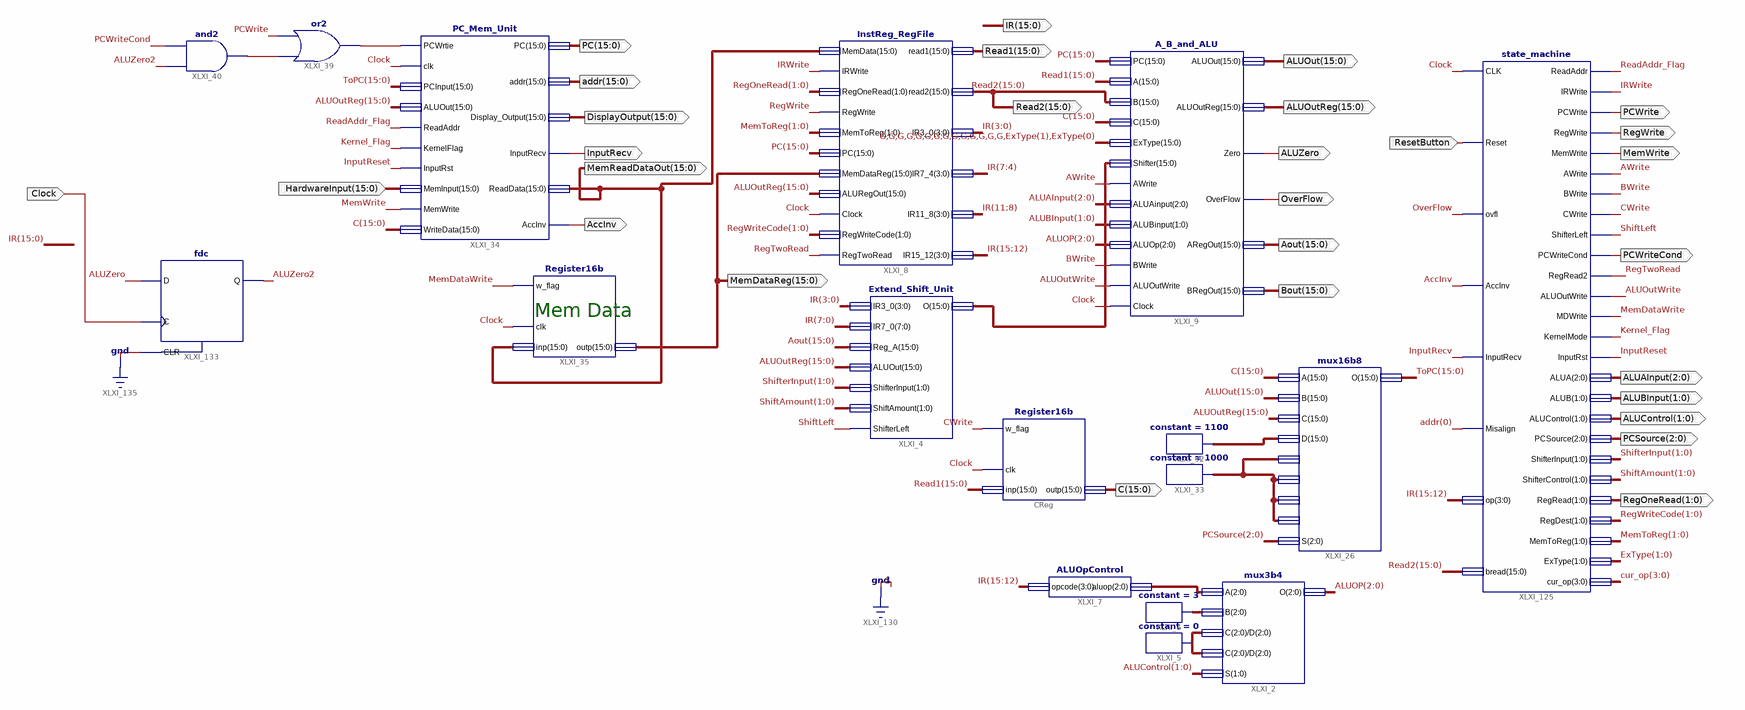
[diagram p0: schematic sheet 1]
// Xilinx ISE schematic Processor_Main_1.sch (spartan3e) as structural Verilog: 17 symbols, 30 ports
module Processor_Main_1 (
  input  Clock,
  input  [15:0] HardwareInput,
  input  ResetButton,
  output [15:0] Read2,
  output [15:0] ALUOut,
  output [15:0] ALUOutReg,
  output ALUZero2,
  output OverFlow,
  output [15:0] Aout,
  output [15:0] Bout,
  output RegWrite,
  output [15:0] Read1,
  output [15:0] PC,
  output [1:0] RegOneRead,
  output MemWrite,
  output [15:0] C,
  output PCWriteCond,
  output PCWrite,
  output [15:0] MemDataReg,
  output [15:0] MemReadDataOut,
  output [15:0] DisplayOutput,
  output [15:0] addr,
  output InputRecv,
  output AccInv,
  output [1:0] ALUBInput,
  output [2:0] ALUAInput,
  output [2:0] PCSource,
  output [1:0] ALUControl,
  output [15:0] IR,
  output ALUZero
);

  wire ALUOutWrite, AWrite, BWrite, CWrite, InputReset, IRWrite, Kernel_Flag, MemDataWrite, ReadAddr_Flag,
       RegTwoRead, ShiftLeft, XLXN_208, XLXN_209;
  wire [1:0] ExType, MemToReg, RegWriteCode, ShiftAmount, ShifterInput;
  wire [2:0] ALUOP, XLXN_41, XLXN_43, XLXN_44;
  wire [3:0] cur_op;
  wire [15:0] Shifter, ToPC, XLXN_171, XLXN_180;

  InstReg_RegFile XLXI_8 (
    .MemData(MemReadDataOut), .IRWrite(IRWrite), .RegOneRead(RegOneRead), .RegWrite(RegWrite),
    .MemToReg(MemToReg), .PC(PC), .MemDataReg(MemDataReg), .ALURegOut(ALUOutReg), .Clock(Clock),
    .RegWriteCode(RegWriteCode), .RegTwoRead(RegTwoRead), .read1(Read1), .read2(Read2), .IR3_0(IR[3:0]),
    .IR7_4(IR[7:4]), .IR11_8(IR[11:8]), .IR15_12(IR[15:12]));
  PC_Mem_Unit XLXI_34 (
    .PCWrtie(XLXN_209), .clk(Clock), .PCInput(ToPC), .ALUOut(ALUOutReg), .ReadAddr(ReadAddr_Flag),
    .KernelFlag(Kernel_Flag), .InputRst(InputReset), .MemInput(HardwareInput), .MemWrite(MemWrite),
    .WriteData(C), .PC(PC), .addr(addr), .Display_Output(DisplayOutput), .InputRecv(InputRecv),
    .ReadData(MemReadDataOut), .AccInv(AccInv));
  or XLXI_39 (XLXN_209, XLXN_208, PCWrite);
  and XLXI_40 (XLXN_208, ALUZero2, PCWriteCond);
  Register16b XLXI_35 (.w_flag(MemDataWrite), .clk(Clock), .inp(MemReadDataOut), .outp(MemDataReg));
  Extend_Shift_Unit XLXI_4 (
    .IR3_0(IR[3:0]), .IR7_0(IR[7:0]), .Reg_A(Aout), .ALUOut(ALUOutReg), .ShifterInput(ShifterInput),
    .ShiftAmount(ShiftAmount), .ShifterLeft(ShiftLeft), .O(Shifter));
  A_B_and_ALU XLXI_9 (
    .PC(PC), .A(Read1), .B(Read2), .C(C), .ExType({{14{1'b0}}, ExType}), .Shifter(Shifter), .AWrite(AWrite),
    .ALUAinput(ALUAInput), .ALUBinput(ALUBInput), .ALUOp(ALUOP), .BWrite(BWrite), .ALUOutWrite(ALUOutWrite),
    .Clock(Clock), .ALUOut(ALUOut), .ALUOutReg(ALUOutReg), .Zero(ALUZero), .OverFlow(OverFlow),
    .ARegOut(Aout), .BRegOut(Bout));
  constant #(.CValue("0")) XLXI_5 (.O(XLXN_41));
  constant #(.CValue("3")) XLXI_6 (.O(XLXN_43));
  ALUOpControl XLXI_7 (.opcode(IR[15:12]), .aluop(XLXN_44));
  constant #(.CValue("1100")) XLXI_32 (.O(XLXN_171));
  constant #(.CValue("1000")) XLXI_33 (.O(XLXN_180));
  Register16b CReg (.w_flag(CWrite), .clk(Clock), .inp(Read1), .outp(C));
  mux3b4 XLXI_2 (.A(XLXN_44), .B(XLXN_43), .C(XLXN_41), .D(XLXN_41), .S(ALUControl), .O(ALUOP));
  mux16b8 XLXI_26 (
    .A(C), .B(ALUOut), .C(ALUOutReg), .D(XLXN_171), .E(XLXN_180), .F(XLXN_180), .G(XLXN_180), .H(XLXN_180),
    .S(PCSource), .O(ToPC));
  state_machine XLXI_125 (
    .CLK(Clock), .Reset(ResetButton), .ovfl(OverFlow), .AccInv(AccInv), .InputRecv(InputRecv),
    .Misalign(addr[0]), .op(IR[15:12]), .bread(Read2), .ReadAddr(ReadAddr_Flag), .IRWrite(IRWrite),
    .PCWrite(PCWrite), .RegWrite(RegWrite), .MemWrite(MemWrite), .AWrite(AWrite), .BWrite(BWrite),
    .CWrite(CWrite), .ShifterLeft(ShiftLeft), .PCWriteCond(PCWriteCond), .RegRead2(RegTwoRead),
    .ALUOutWrite(ALUOutWrite), .MDWrite(MemDataWrite), .KernelMode(Kernel_Flag), .InputRst(InputReset),
    .ALUA(ALUAInput), .ALUB(ALUBInput), .ALUControl(ALUControl), .PCSource(PCSource),
    .ShifterInput(ShifterInput), .ShifterControl(ShiftAmount), .RegRead(RegOneRead), .RegDest(RegWriteCode),
    .MemToReg(MemToReg), .ExType(ExType), .cur_op(cur_op));
  fdc XLXI_133 (.C(Clock), .CLR(1'b0), .D(ALUZero), .Q(ALUZero2));

  // Notes on the sheet:
  //   Mem Data
endmodule
